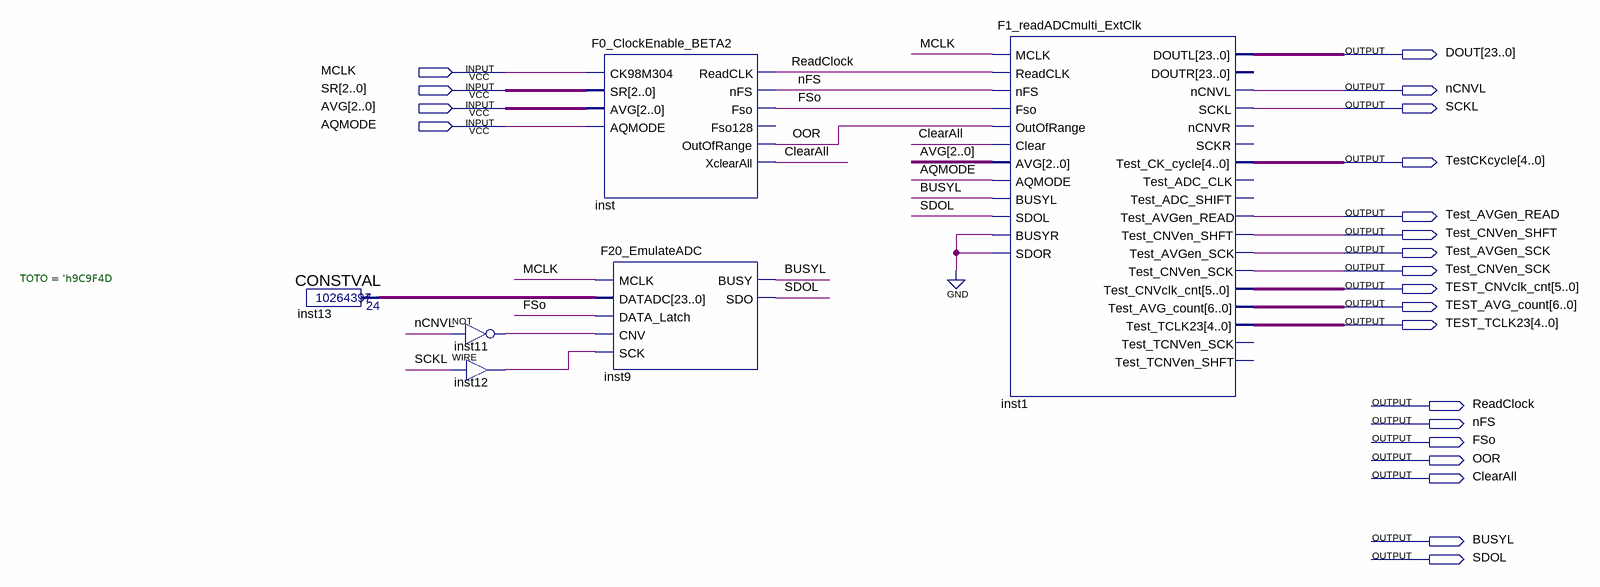
[diagram p0: schematic sheet]
// Quartus schematic TEST_Multimodes_ExtClockEnable.bdf as structural Verilog: 6 symbols, 22 pins
module TEST_Multimodes_ExtClockEnable (
  input  MCLK,
  input  [2:0] SR,
  input  [2:0] AVG,
  input  AQMODE,
  output [23:0] DOUT,
  output nCNVL,
  output SCKL,
  output [4:0] TestCKcycle,
  output Test_AVGen_READ,
  output Test_CNVen_SHFT,
  output Test_AVGen_SCK,
  output Test_CNVen_SCK,
  output [5:0] TEST_CNVclk_cnt,
  output [6:0] TEST_AVG_count,
  output [4:0] TEST_TCLK23,
  output ReadClock,
  output nFS,
  output FSo,
  output OOR,
  output ClearAll,
  output BUSYL,
  output SDOL
);

  wire inst11_out, inst12_out;
  wire [23:0] inst13_result;

  CONSTVAL #(.TOTO('h9C9F4D)) inst13 (.result(inst13_result));
  not inst11 (inst11_out, nCNVL);
  assign inst12_out = SCKL;  // WIRE inst12
  F0_ClockEnable_BETA2 inst (
    .CK98M304(MCLK), .SR(SR), .AVG(AVG), .AQMODE(AQMODE), .ReadCLK(ReadClock), .nFS(nFS), .Fso(FSo),
    .OutOfRange(OOR), .XclearAll(ClearAll));  // open: Fso128
  F20_EmulateADC inst9 (
    .MCLK(MCLK), .DATADC(inst13_result), .DATA_Latch(FSo), .CNV(inst11_out), .SCK(inst12_out), .BUSY(BUSYL),
    .SDO(SDOL));
  F1_readADCmulti_ExtClk inst1 (
    .MCLK(MCLK), .ReadCLK(ReadClock), .nFS(nFS), .Fso(FSo), .OutOfRange(OOR), .Clear(ClearAll), .AVG(AVG),
    .AQMODE(AQMODE), .BUSYL(BUSYL), .SDOL(SDOL), .BUSYR(1'b0), .SDOR(1'b0), .DOUTL(DOUT), .nCNVL(nCNVL),
    .SCKL(SCKL), .Test_CK_cycle(TestCKcycle), .Test_AVGen_READ(Test_AVGen_READ),
    .Test_CNVen_SHFT(Test_CNVen_SHFT), .Test_AVGen_SCK(Test_AVGen_SCK), .Test_CNVen_SCK(Test_CNVen_SCK),
    .Test_CNVclk_cnt(TEST_CNVclk_cnt), .Test_AVG_count(TEST_AVG_count), .Test_TCLK23(TEST_TCLK23));  // open: DOUTR, nCNVR, SCKR, Test_ADC_CLK, Test_ADC_SHIFT, Test_TCNVen_SCK, Test_TCNVen_SHFT
endmodule
